# EAGLE design schematic_smd (EAGLE 9.3.2)
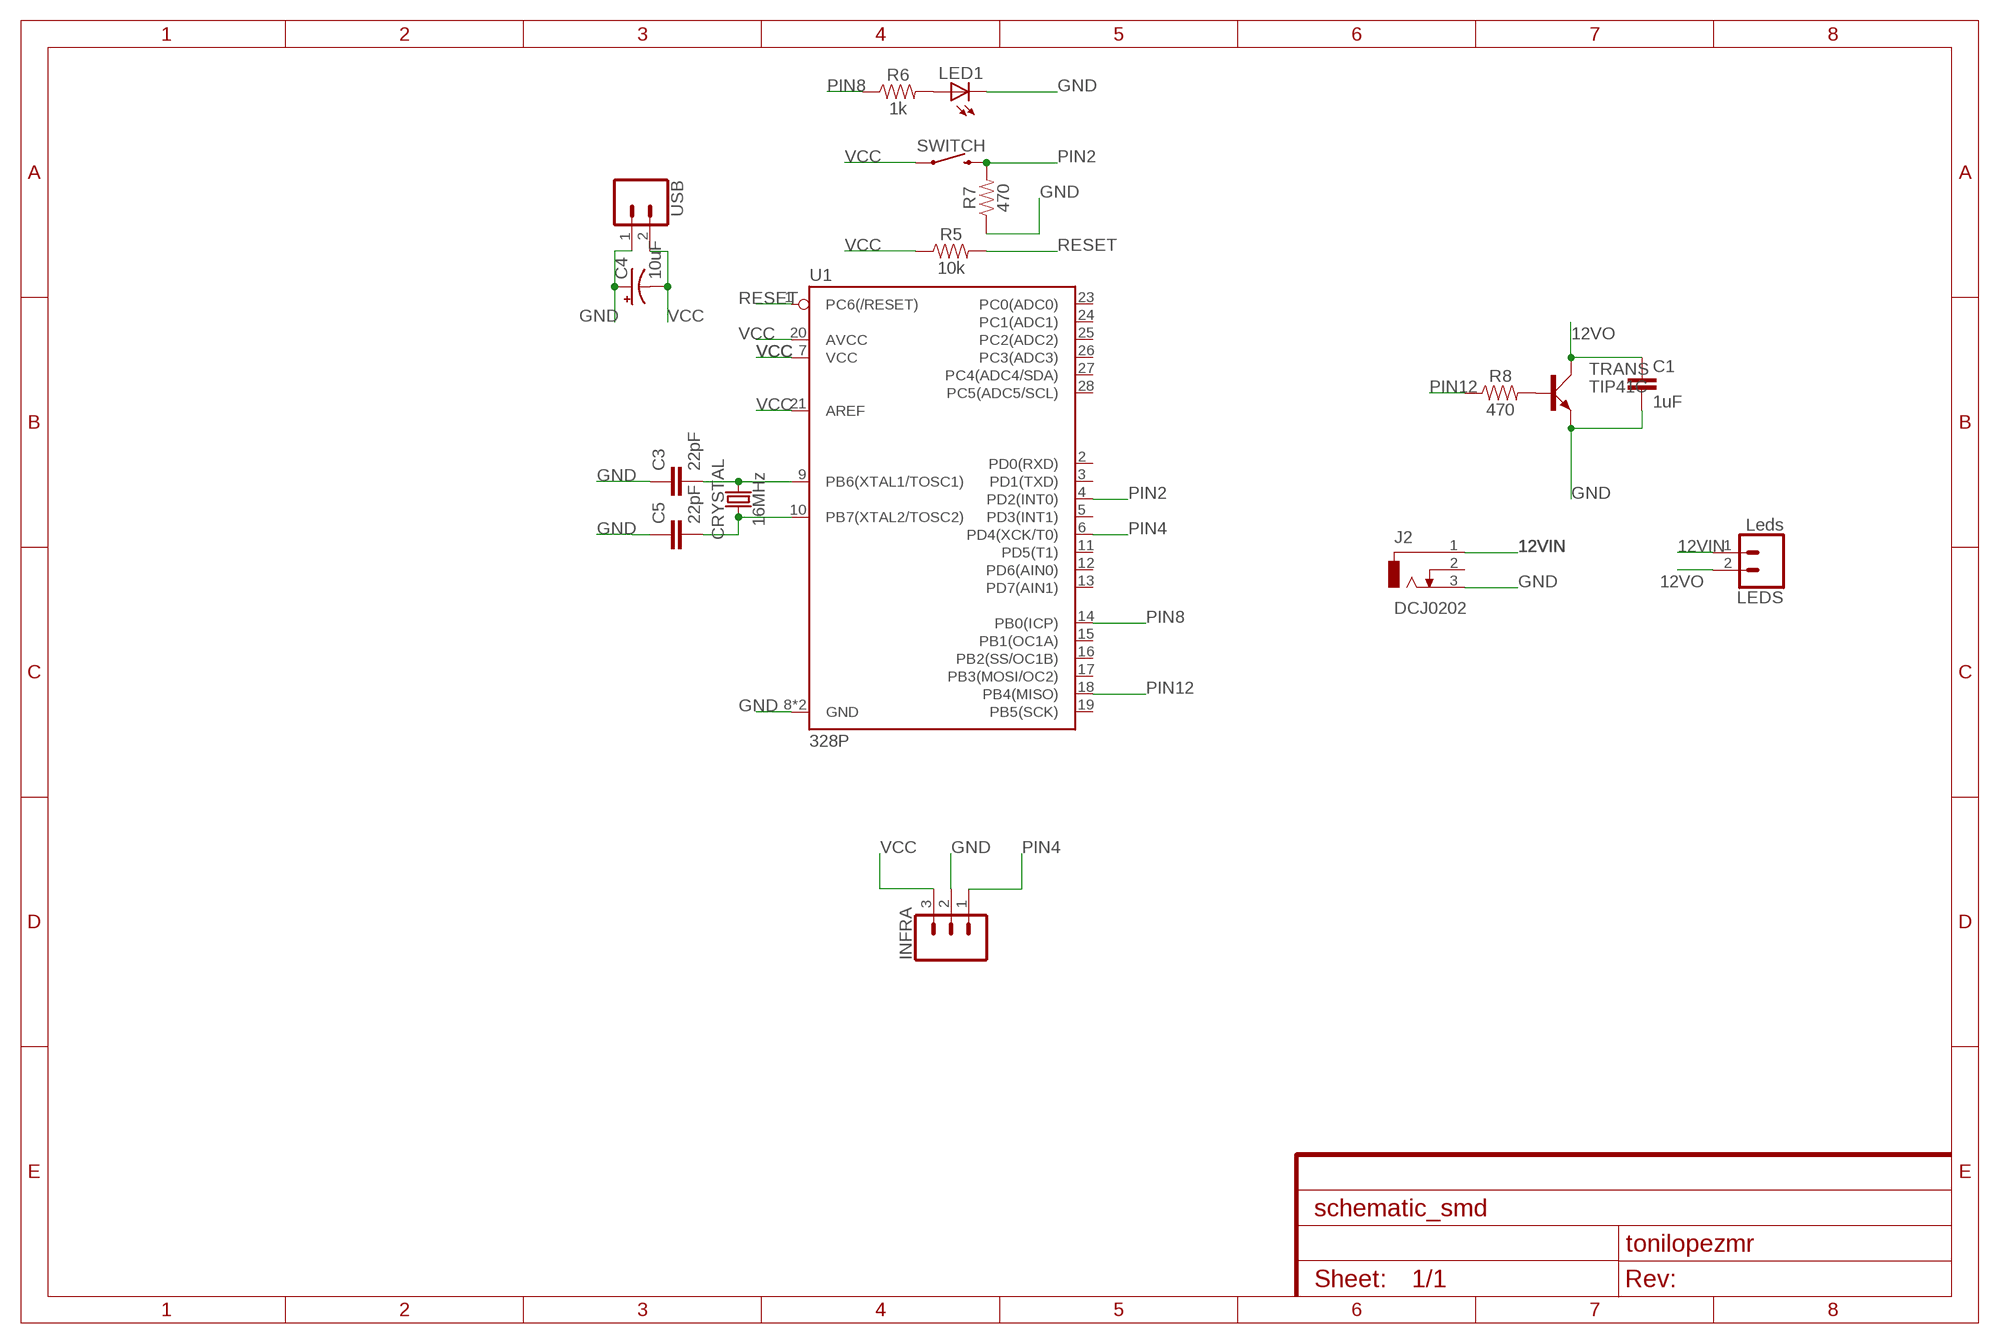
[diagram p0: schematic, sheet 1]
FRAME1 (FRAME-A4L): DESIGNER: tonilopezmr; REV: 1

## Parts
C1  1uF  1.0UF-1206-50V-10%  [1206]
C3  22pF  1.0UF-1206-50V-10%  [1206]
C4  10uF  10UF-POLAR-RADIAL-2.5MM-25V-20%  [CPOL-RADIAL-2.5MM-5MM]
C5  22pF  1.0UF-1206-50V-10%  [1206]
CRYSTAL  16MHz  CRYSTAL-16MHZPTH-HC49US  [HC49US]
INFRA  455-1750-1-ND  CONN_03  [1X03]
J2  DCJ0202  [DCJ0202]
LED1  LED5MM  [LED5MM]
LEDS  Leds  CONN_02JST-PTH-2-KIT  [JST-2-PTH-KIT]
R5  10k  0.22OHM-0805-1/4W-1%  [0805]
R6  1k  10OHM-1206-1/4W-1%  [1206]
R7  470  10OHM-1206-1/4W-1%  [1206]
R8  470  10OHM-1206-1/4W-1%  [1206]
SWITCH  MOMENTARY-SWITCH-SPST-PTH-6.0MM  [TACTILE_SWITCH_PTH_6.0MM]
TRANS  TIP41C  [TO220AV]
U1  328P  ATMEGA328P_PDIP  [DIP28]
USB  CONN_02JST-PTH-2-KIT  [JST-2-PTH-KIT]

## Nets
12VIN: J2.1 LEDS.1
12VO: C1.1 LEDS.2 TRANS.C
GND: C1.2 C3.1 C4.1(+) C5.1 INFRA.2 J2.3 LED1.K(C) R7.1 TRANS.E U1.8(GND) U1.22(GND) USB.1
N$1: C5.2 CRYSTAL.1 U1.10(PB7(XTAL2/TOSC2))
N$2: C3.2 CRYSTAL.2 U1.9(PB6(XTAL1/TOSC1))
N$3: LED1.A R6.2
N$4: R8.2 TRANS.B
PIN2: R7.2 SWITCH.3 U1.4(PD2(INT0))
PIN4: INFRA.1 U1.6(PD4(XCK/T0))
PIN8: R6.1 U1.14(PB0(ICP))
PIN12: R8.1 U1.18(PB4(MISO))
RESET: R5.2 U1.1(PC6(/RESET))
VCC: C4.2(-) INFRA.3 R5.1 SWITCH.1 U1.7(VCC) U1.20(AVCC) U1.21(AREF) USB.2
Unconnected: J2.2 U1.2(PD0(RXD)) U1.3(PD1(TXD)) U1.5(PD3(INT1)) U1.11(PD5(T1)) U1.12(PD6(AIN0)) U1.13(PD7(AIN1)) U1.15(PB1(OC1A)) U1.16(PB2(SS/OC1B)) U1.17(PB3(MOSI/OC2)) U1.19(PB5(SCK)) U1.23(PC0(ADC0)) U1.24(PC1(ADC1)) U1.25(PC2(ADC2)) U1.26(PC3(ADC3)) U1.27(PC4(ADC4/SDA)) U1.28(PC5(ADC5/SCL))

## Library data of the parts
C1 C3 C5 = SparkFun-Capacitors:1.0UF: 1µF ceramic capacitors A capacitor is a passive two-terminal electrical component used to store electrical energy temporarily in an electric field.; PROD_ID: CAP-09822; VALUE: 1.0uF
C4 = SparkFun-Capacitors:10UF-POLAR: 10.0µF polarized capacitors A capacitor is a passive two-terminal electrical component used to store electrical energy temporarily in an electric field.; PROD_ID: CAP-08440
CRYSTAL = SparkFun-Clocks:CRYSTAL-16MHZ: 16MHz Crystal Digikey Example <http://www.digikey.com/product-search/en?keywords=535-9122-1-ND> Frequency: 16MHz Frequency Stability: ±50ppm Frequency Tolerance: ±20ppm Load Capacitance: 18pF SparkFun Products: Pro Micro -5V/16MHz <https://www.sparkfun.com/products/12640> SparkFun Serial Enabled LCD Kit <https://www.sparkfun.com/products/10097>; PROD_ID: XTAL-08181; SF_ID: COM-00536
INFRA = SparkFun-Connectors:CONN_03: Multi connection point. Often used as Generic Header-pin footprint for 0.1 inch spaced/style header connections On any of the 0.1 inch spaced packages, you can populate with these: Break Away Headers - Straight <https://www.sparkfun.com/products/116> (PRT-00116) Break Away Male Headers - Right Angle <https://www.sparkfun.com/products/553> (PRT-00553) Female Headers <https://www.sparkfun.com/products/115> (PRT-00115) Break Away Headers - Machine Pin <https://www.sparkfun.com/products/117> (PRT-00117) Break Away Female Headers - Swiss Machine Pin <https://www.sparkfun.com/products/743> (PRT-00743) Stackable Header - 3 Pin (Female, 0.1") <https://www.sparkfun.com/products/13875> (PRT-13875) For SCREWTERMINALS and SPRING TERMINALS visit here: Screw Terimnals on SparkFun.com <https://www.sparkfun.com/search/results?term=Screw+Terminals> (5mm/3.5mm/2.54mm spacing) This device is also useful as a general connection point to wire up your design to another part of your project. Our various solder wires solder well into these plated through hole pads. Hook-Up Wire - Assortment (Stranded, 22 AWG) <https://www.sparkfun.com/products/11375> (PRT-11375) Hook-Up Wire - Assortment (Solid Core, 22 AWG) <https://www.sparkfun.com/products/11367> (PRT-11367) View the entire wire category on our website here <https://www.sparkfun.com/categories/141> Special notes: Molex polarized connector foot print use with SKU : PRT-08232 with associated crimp pins and housings.; PROD_ID: XXX-00000
J2 = con-jack:DCJ0202: DC POWER JACK Source: DCJ0202.pdf; OC_FARNELL: unknown; OC_NEWARK: unknown
LED1 = adafruit:LED: LED OSRAM: - CHIPLED LG R971, LG N971, LY N971, LG Q971, LY Q971, LO R971, LY R971 LH N974, LH R974 LS Q976, LO Q976, LY Q976 LO Q996 - Hyper CHIPLED LW Q18S LB Q993, LB Q99A, LB R99A - SideLED LS A670, LO A670, LY A670, LG A670, LP A670 LB A673, LV A673, LT A673, LW A673 LH A674 LY A675 LS A676, LA A676, LO A676, LY A676, LW A676 LS A679, LY A679, LG A679 - Hyper Micro SIDELED® LS Y876, LA Y876, LO Y876, LY Y876 LT Y87S - SmartLED LW L88C, LW L88S LB L89C, LB L89S, LG L890 LS L89K, LO L89K, LY L89K LS L896, LA L896, LO L896, LY L896 - TOPLED LS T670, LO T670, LY T670, LG T670, LP T670 LSG T670, LSP T670, LSY T670, LOP T670, LYG T670 LG T671, LOG T671, LSG T671 LB T673, LV T673, LT T673, LW T673 LH T674 LS T676, LA T676, LO T676, LY T676, LB T676, LH T676, LSB T676, LW T676 LB T67C, LV T67C, LT T67C, LS T67K, LO T67K, LY T67K, LW E67C LS E67B, LA E67B, LO E67B, LY E67B, LB E67C, LV E67C, LT E67C LW T67C LS T679, LY T679, LG T679 LS T770, LO T770, LY T770, LG T770, LP T770 LB T773, LV T773, LT T773, LW T773 LH T774 LS E675, LA E675, LY E675, LS T675 LS T776, LA T776, LO T776, LY T776, LB T776 LHGB T686 LT T68C, LB T68C - Hyper Mini TOPLED® LB M676 - Mini TOPLED Santana® LG M470 LS M47K, LO M47K, LY M47K Source: http://www.osram.convergy.de/
LEDS USB = SparkFun-Connectors:CONN_02: Multi connection point. Often used as Generic Header-pin footprint for 0.1 inch spaced/style header connections On any of the 0.1 inch spaced packages, you can populate with these: Break Away Headers - Straight <https://www.sparkfun.com/products/116> (PRT-00116) Break Away Male Headers - Right Angle <https://www.sparkfun.com/products/553> (PRT-00553) Female Headers <https://www.sparkfun.com/products/115> (PRT-00115) Break Away Headers - Machine Pin <https://www.sparkfun.com/products/117> (PRT-00117) Break Away Female Headers - Swiss Machine Pin <https://www.sparkfun.com/products/743> (PRT-00743) For SCREWTERMINALS and SPRING TERMINALS visit here: Screw Terimnals on SparkFun.com <https://www.sparkfun.com/search/results?term=Screw+Terminals> (5mm/3.5mm/2.54mm spacing) This device is also useful as a general connection point to wire up your design to another part of your project. Our various solder wires solder well into these plated through hole pads. Hook-Up Wire - Assortment (Stranded, 22 AWG) <https://www.sparkfun.com/products/11375> (PRT-11375) Hook-Up Wire - Assortment (Solid Core, 22 AWG) <https://www.sparkfun.com/products/11367> (PRT-11367) View the entire wire category on our website here <https://www.sparkfun.com/categories/141> Special notes: Molex polarized connector foot print use with: PRT-08233 with associated crimp pins and housings. 2.54_SCREWTERM for use with PRT-10571. 3.5mm Screw Terminal footprints for PRT-08084 5mm Screw Terminal footprints for use with PRT-08432
R5 = SparkFun-Resistors:0.22OHM: 0.22Ω resistor A resistor is a passive two-terminal electrical component that implements electrical resistance as a circuit element. Resistors act to reduce current flow, and, at the same time, act to lower voltage levels within circuits. - Wikipedia; PROD_ID: RES-09883; VALUE: 0.22
R6-R8 = SparkFun-Resistors:10OHM: 10Ω resistor A resistor is a passive two-terminal electrical component that implements electrical resistance as a circuit element. Resistors act to reduce current flow, and, at the same time, act to lower voltage levels within circuits. - Wikipedia; PROD_ID: RES-08705; VALUE: 10
SWITCH = SparkFun-Switches:MOMENTARY-SWITCH-SPST: Momentary Switch (Pushbutton) - SPST Normally-open (NO) SPST momentary switches (buttons, pushbuttons). Variants PTH-12MM - 12mm square, through-hole Momentary Pushbutton Switch - 12mm Square <https://www.sparkfun.com/products/9190> (COM-09190) PTH-6.0MM, PTH-6.0MM-KIT - 6.0mm square, through-hole Mini Pushbutton Switch <https://www.sparkfun.com/products/97> (COM-00097) KIT package intended for soldering kit's - only one side of pads' copper is exposed. PTH-RIGHT-ANGLE-KIT - Right-angle, through-hole Right Angle Tactile Button <https://www.sparkfun.com/products/10791> - Used on SparkFun BigTime Watch Kit <https://www.sparkfun.com/products/11734> SMD-12MM - 12mm square, surface-mount Tactile Button - SMD (12mm) <https://www.sparkfun.com/products/12993> (COM-12993) Used on SparkFun PicoBoard <https://www.sparkfun.com/products/11888> SMD-4.5MM - 4.5mm Square Trackball Switch Used on SparkFun Blackberry Trackballer Breakout <https://www.sparkfun.com/products/13169> SMD-4.6MMX2.8MM - 4.60mm x 2.80mm, surface mount Used on SparkFun SAMD21 Mini Breakout <https://www.sparkfun.com/products/13664> SMD-5.2MM, SMD-5.2-REDUNDANT - 5.2mm square, surface-mount Mini Pushbutton Switch - SMD <https://www.sparkfun.com/products/8720> (COM-08720) Used on Arduino Pro Mini <https://www.sparkfun.com/products/11114> REDUNDANT package connects both switch circuits together SMD-6.0X3.5MM - 6.0 x 3.5mm, surface mount Momentary Reset Switch SMD <https://www.sparkfun.com/products/8229> (COM-08229) SMD-6.2MM-TALL - 6.2mm square, surface mount Tactile Button - SMD (6mm) <https://www.sparkfun.com/products/12992> Used on SparkFun Digital Sandbox <https://www.sparkfun.com/products/12651> SMD-RIGHT-ANGLE - Right-angle, surface mount Used on SparkFun Block for Intel® Edison - Arduino <https://www.sparkfun.com/products/13036>; PROD_ID: SWCH-08441; SF_SKU: COM-00097
TRANS = transistor-power:TIP41C: NPN TRANSISTOR
U1 = SparkFun-IC-Microcontroller:ATMEGA328P_PDIP: Atmel 328P Through hole ATMEGA328P uC used in the Arduino 32kb flash, 1k EEPROM, 2k SRAM Datasheet <http://www.sparkfun.com/datasheets/Components/SMD/ATMega328.pdf> SparkFun Products Storefront component: AVR 28 Pin 20MHz 32K 6A/D - ATMega328P <https://www.sparkfun.com/products/9061> (COM-09061) SparkFun Simon Says - Through-Hole Soldering Kit <https://www.sparkfun.com/products/10547> (KIT-10547) SparkFun Learn to Solder - Simon Says <https://www.sparkfun.com/products/13708> (KIT-13708) SparkFun BigTime Watch Kit <https://www.sparkfun.com/products/11734> (KIT-11734) SparkFun ClockIt <https://www.sparkfun.com/products/10930> (KIT-10930) SparkFun Serial Enabled LCD Kit <https://www.sparkfun.com/products/10097> (LCD-10097) SparkFun Simon Tilts - Through Hole Soldering Kit <https://www.sparkfun.com/products/12634> (KIT-12634) SparkFun Frequency Counter Kit <https://www.sparkfun.com/products/10140> (KIT-10140) FabFM Radio Kit <https://www.sparkfun.com/products/11043> (KIT-11043) SparkFun Binary Blaster Kit <https://www.sparkfun.com/products/12037> (KIT-12037) SparkFun Metro-Gnome <https://www.sparkfun.com/products/9236> (KIT-09236) ATmega328 with Arduino Optiboot (Uno) <https://www.sparkfun.com/products/10524> (DEV-10524); PROD_ID: IC-09136

## Board
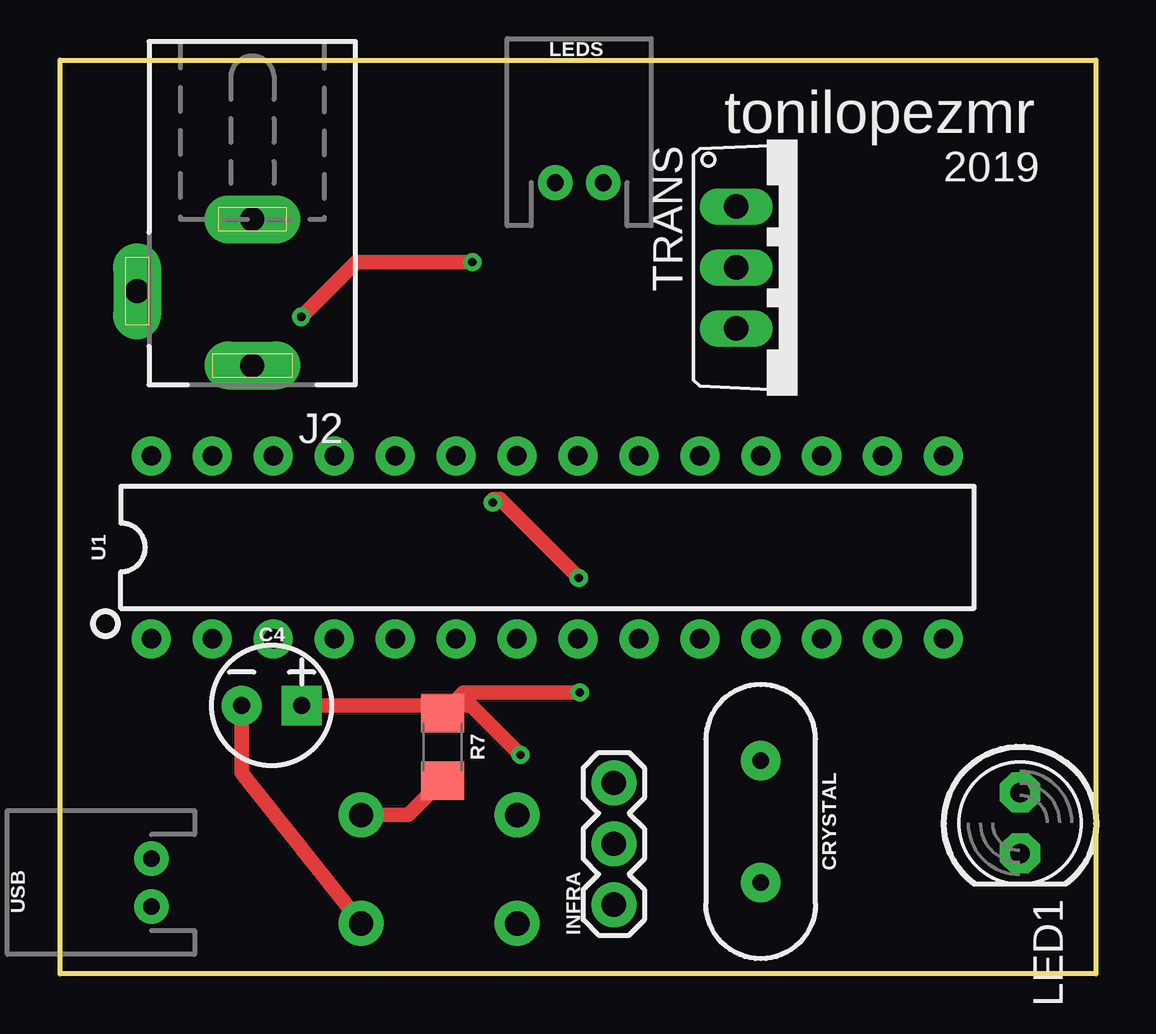
[diagram p1: board, top side]
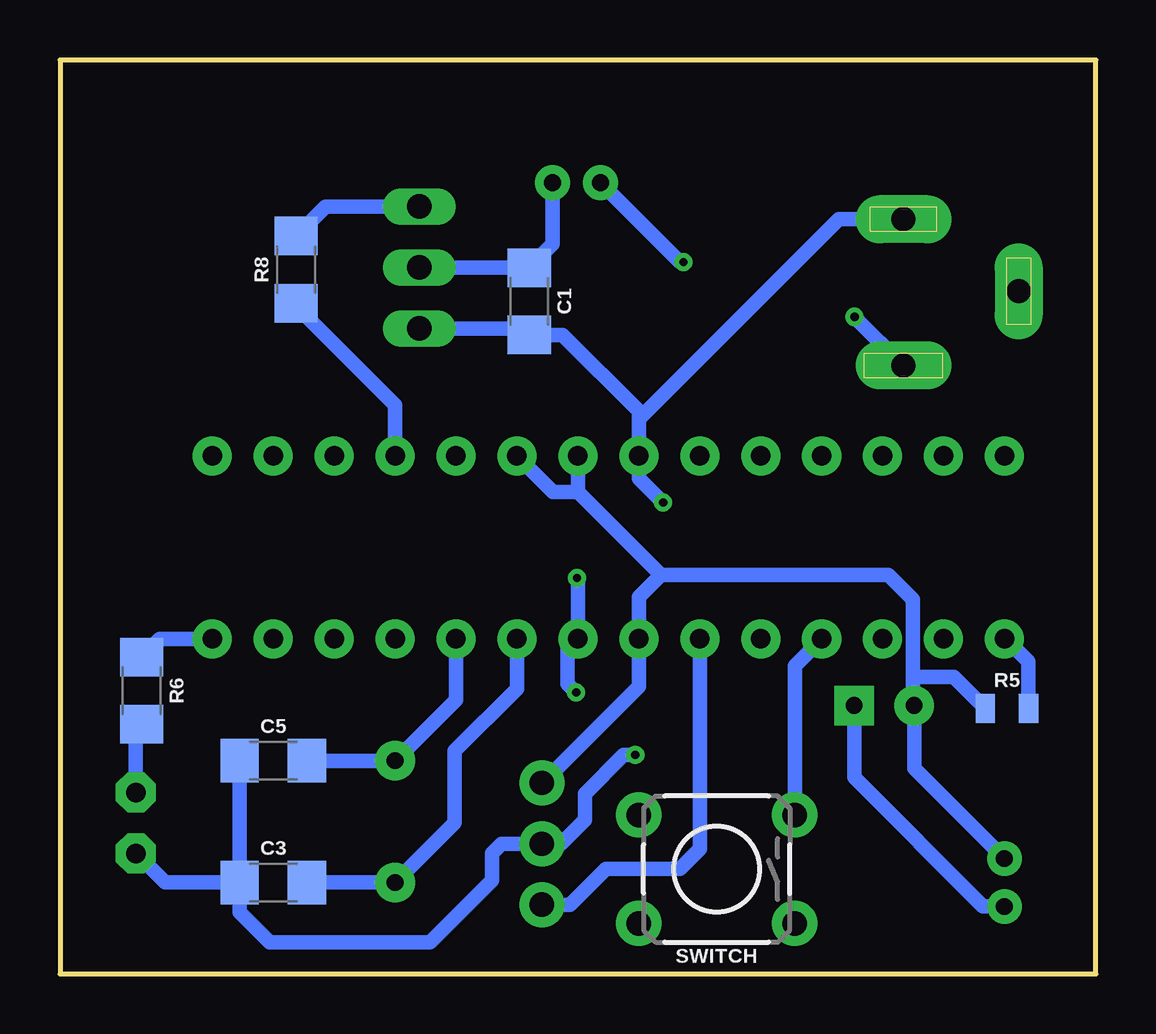
[diagram p2: board, bottom side, seen from below]

Size 43.18 x 38.1 mm. Coordinates in mm from the lower left corner, seen from the top.
Outline: 0,0 0,38.1 43.18,38.1 43.18,0 0,0
Copper layers (1*16): Top 0.035mm / dielectric 1.5mm / Bottom 0.035mm
Design rules "default": minimum track width 6mil, minimum drill 0.35mm, track to track 6mil, track to pad 6mil, pad to pad 6mil, via to via 6mil, smd to smd 6mil, copper to edge 40mil, drill to drill 6mil, minimum pad ring 10mil, minimum via ring 8mil, stop-mask expansion 4mil, vias tented up to drill 0mil, thermal gap 10mil

### Footprints (pad centres in the part's own frame; a part is rotated, then mirrored left to right if it is on the bottom)
1206 = smd 1.6 x 1.8: 1 -1.4,0; 2 1.4,0
CPOL-RADIAL-2.5MM-5MM = drill 0.7 pad 1.651 square: 1 1.25,0 | drill 0.7 pad 1.651: 2 -1.25,0
HC49US = drill 0.7 pad 1.651: 1 -2.54,0; 2 2.54,0
1X03 = drill 1.016 pad 1.88: 1 0,0; 2 2.54,0; 3 5.08,0
DCJ0202 = drill 1 pad 2 long: 1 0,3.1; 2 4.8,0; 3 0,-3
LED5MM = drill 0.813 pad 1.676 octagon: A -1.27,0; K 1.27,0
JST-2-PTH-KIT = drill 0.7 pad 1.448: 1 -1,0; 2 1,0
0805 = smd 0.8 x 1.2: 1 -0.9,0; 2 0.9,0
TACTILE_SWITCH_PTH_6.0MM = drill 1.016 pad 1.88: 1 -3.251,2.261; 2 3.251,2.261; 3 -3.251,-2.261; 4 3.251,-2.261
TO220AV = drill 1.016 long: B -2.54,-2.54; C 0,-2.54; E 2.54,-2.54
DIP28 = drill 0.813 pad 1.626: 1 -16.51,-3.81; 2 -13.97,-3.81; 3 -11.43,-3.81; 4 -8.89,-3.81; 5 -6.35,-3.81; 6 -3.81,-3.81; 7 -1.27,-3.81; 8 1.27,-3.81; 9 3.81,-3.81; 10 6.35,-3.81; 11 8.89,-3.81; 12 11.43,-3.81; 13 13.97,-3.81; 14 16.51,-3.81; 15 16.51,3.81; 16 13.97,3.81; 17 11.43,3.81; 18 8.89,3.81; 19 6.35,3.81; 20 3.81,3.81; 21 1.27,3.81; 22 -1.27,3.81; 23 -3.81,3.81; 24 -6.35,3.81; 25 -8.89,3.81; 26 -11.43,3.81; 27 -13.97,3.81; 28 -16.51,3.81

### Placement (x,y rotation side)
C1  23.62,28.04 270 bottom
C3  34.29,3.81 0 bottom
C4  8.82,11.19 0 top
C5  34.29,8.89 0 bottom
CRYSTAL  29.21,6.35 270 top
INFRA  23.09,2.88 90 top
J2  8.02,28.46 180 top
LED1  40.02,6.3 270 top
LEDS  21.64,32.99 0 top
R5  3.71,11.07 0 bottom
R6  39.78,11.81 270 bottom
R7  15.95,9.46 270 top
R8  33.34,29.36 90 bottom
SWITCH  15.81,4.37 180 bottom
TRANS  30.73,29.45 270 top
U1  20.32,17.78 0 top
USB  3.81,3.81 90 top

### Tracks (layer width: path | path; a pad name or v marks a point on that pad's centre or on a via)
12VIN  (via drill 0.35)
  Top 0.61: v17.19,29.67 12.34,29.67 v10.06,27.39
  Bottom 0.61: LEDS.1 17.33,29.67 v17.19,29.67 | v10.06,27.39 8.03,25.36 J2.1
12VO
  Bottom 0.61: TRANS.C C1.1 | C1.1 | LEDS.2 22.64,30.43 C1.1
GND  (via drill 0.35)
  Top 0.61: R7.1 15.62,11.19 | 15.62,11.19 C4.1 | 21.59,11.77 21.62,11.73 v21.66,11.73 16.82,11.73 R7.1 | 16.16,10.65 R7.1 | 19.27,9.13 v19.2,9.13 17.14,11.19 15.62,11.19 | v21.63,16.5 18.34,19.79 18.07,19.79 18.07,19.68 v18.04,19.65
  Bottom 0.61: USB.1 4.7,2.81 10.07,8.18 C4.1 | v21.66,11.73 22.02,12.09 22.02,13.54 U1.8 21.59,16.38 21.66,16.45 21.63,16.48 v21.63,16.5 | C3.1 35.69,2.56 34.45,1.32 27.75,1.32 25.16,3.91 25.16,5.04 24.77,5.42 INFRA.2 22.29,5.42 21.3,6.42 21.3,7.51 19.68,9.13 v19.2,9.13 | C3.1 C5.1 | C3.1 38.8,3.81 LED1.K | v18.04,19.65 19.05,20.66 U1.22 19.05,23.13 | J2.3 10.71,31.46 19.05,23.13 | TRANS.E 23.89,26.91 C1.2 22.23,26.64 19.05,23.46 19.05,23.13
N$1
  Bottom 0.61: U1.10 26.67,11.43 CRYSTAL.1 C5.2
N$2
  Bottom 0.61: U1.9 24.13,11.89 26.73,9.29 26.73,6.29 CRYSTAL.2 C3.2
N$3
  Bottom 0.61: R6.2 40.02,10.17 LED1.A
N$4
  Bottom 0.61: TRANS.B 32.11,31.99 R8.2
PIN2
  Top 0.61: SWITCH.3 14.51,6.63 R7.2
  Bottom 0.61: U1.4 12.55,12.85 SWITCH.3
PIN4
  Bottom 0.61: U1.6 16.51,5.21 17.34,4.38 20.43,4.38 21.92,2.88 INFRA.1
PIN8
  Bottom 0.61: R6.1 39.02,13.97 U1.14
PIN12
  Bottom 0.61: R8.1 33.34,27.85 29.21,23.72 U1.18
RESET
  Bottom 0.61: R5.2 2.81,13.02 3.76,13.97 U1.1
VCC
  Top 0.61: SWITCH.1 7.58,8.38 C4.2
  Bottom 0.61: USB.2 7.58,8.57 C4.2 | C4.2 7.45,11.07 | 7.62,12.38 7.62,14.5 7.63,14.5 7.63,15.6 8.66,16.64 18.13,16.64 | 7.62,12.38 7.62,11.23 C4.2 | 18.13,16.64 19.05,15.71 U1.7 19.05,11.98 23.06,7.96 INFRA.3 | 18.13,16.64 21.59,20.1 | 21.59,20.1 U1.21 | 21.59,20.1 22.64,20.1 U1.20 | 7.62,12.38 5.92,12.38 R5.1

### Text on the board
tPlace: tonilopezmr | 2019